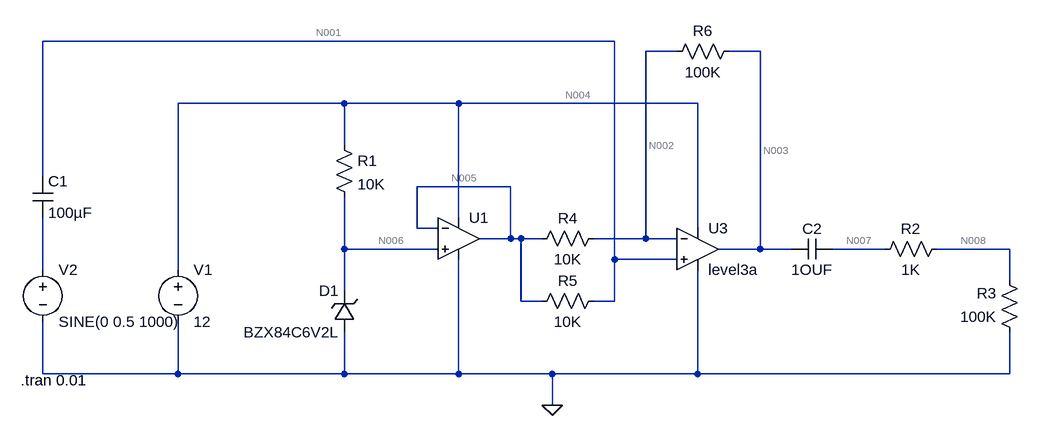
[diagram p0: schematic OUT_AMP_01.asc]
OUT_AMP_01.asc, the LTspice schematic file:
Version 4
SHEET 1 996 680
WIRE 368 -112 -512 -112
WIRE 464 -96 416 -96
WIRE 592 -96 544 -96
WIRE -48 -16 -304 -16
WIRE 128 -16 -48 -16
WIRE 496 -16 128 -16
WIRE -48 48 -48 -16
WIRE -512 96 -512 -112
WIRE 208 112 64 112
WIRE 128 160 128 -16
WIRE 64 176 64 112
WIRE 96 176 64 176
WIRE 496 176 496 -16
WIRE 208 192 208 112
WIRE 208 192 160 192
WIRE 224 192 208 192
WIRE 256 192 224 192
WIRE 416 192 416 -96
WIRE 416 192 336 192
WIRE 464 192 416 192
WIRE -48 208 -48 128
WIRE 96 208 -48 208
WIRE 592 208 592 -96
WIRE 592 208 528 208
WIRE 640 208 592 208
WIRE 784 208 704 208
WIRE 976 208 864 208
WIRE 368 224 368 -112
WIRE 464 224 368 224
WIRE -512 240 -512 160
WIRE -304 240 -304 -16
WIRE 976 256 976 208
WIRE -48 272 -48 208
WIRE 224 288 224 192
WIRE 256 288 224 288
WIRE 368 288 368 224
WIRE 368 288 336 288
WIRE -512 400 -512 320
WIRE -304 400 -304 320
WIRE -304 400 -512 400
WIRE -48 400 -48 336
WIRE -48 400 -304 400
WIRE 128 400 128 224
WIRE 128 400 -48 400
WIRE 272 400 128 400
WIRE 496 400 496 240
WIRE 496 400 272 400
WIRE 976 400 976 336
WIRE 976 400 496 400
WIRE 272 448 272 400
FLAG 272 448 0
DATAFLAG 32 208 ""
SYMBOL Opamps\\UniversalOpamp 128 192 R0
SYMATTR InstName U1
SYMBOL res -64 32 R0
SYMATTR InstName R1
SYMATTR Value 10K
SYMBOL voltage -304 224 R0
SYMATTR InstName V1
SYMATTR Value 12
SYMBOL voltage -512 224 R0
WINDOW 123 0 0 Left 0
WINDOW 39 0 0 Left 0
SYMATTR InstName V2
SYMATTR Value SINE(0 0.5 1000)
SYMBOL zener -32 336 R180
WINDOW 0 24 64 Left 2
WINDOW 3 24 0 Left 2
SYMATTR InstName D1
SYMATTR Value BZX84C6V2L
SYMBOL cap -528 96 R0
SYMATTR InstName C1
SYMATTR Value 100µF
SYMBOL cap 704 192 R90
WINDOW 0 0 32 VBottom 2
WINDOW 3 32 32 VTop 2
SYMATTR InstName C2
SYMATTR Value 1OUF
SYMBOL res 880 192 R90
WINDOW 0 0 56 VBottom 2
WINDOW 3 32 56 VTop 2
SYMATTR InstName R2
SYMATTR Value 1K
SYMBOL res 992 352 R180
WINDOW 0 36 76 Left 2
WINDOW 3 36 40 Left 2
SYMATTR InstName R3
SYMATTR Value 100K
SYMBOL res 352 176 R90
WINDOW 0 0 56 VBottom 2
WINDOW 3 32 56 VTop 2
SYMATTR InstName R4
SYMATTR Value 10K
SYMBOL res 352 272 R90
WINDOW 0 0 56 VBottom 2
WINDOW 3 32 56 VTop 2
SYMATTR InstName R5
SYMATTR Value 10K
SYMBOL res 560 -112 R90
WINDOW 0 0 56 VBottom 2
WINDOW 3 32 56 VTop 2
SYMATTR InstName R6
SYMATTR Value 100K
SYMBOL Opamps\\UniversalOpamp3 496 208 R0
SYMATTR InstName U3
TEXT -546 410 Left 2 !.tran 0.01

The netlist it stands for:
* OUT_AMP_01.asc
XU1 N006 N005 N004 0 N005 level1 Avol=1Meg GBW=10Meg Vos=0 En=0 Enk=0 In=0 Ink=0 Rin=500Meg  ; pins In+ In- V+ V- OUT
R1 N004 N006 10K
V1 N004 0 12
V2 N009 0 SINE(0 0.5 1000)
D1 0 N006 BZX84C6V2L
C1 N001 N009 100µF
C2 N007 N003 1OUF
R2 N008 N007 1K
R3 0 N008 100K
R4 N002 N005 10K
R5 N001 N005 10K
R6 N003 N002 100K
XU3 N001 N002 N004 0 N003 level3a  ; pins In+ In- V+ V- OUT
.model D D
.lib standard.dio
.tran 0.01
.lib UniversalOpAmp1.lib
.backanno
.end

* Results of the author's LTspice run, read from the files saved beside the schematic
* Operating Point, zero values left out:
*   V(n005) = 6.159 V
*   V(n006) = 6.159 V
*   V(n004) = 12 V
*   V(n001) = 6.159 V
*   V(n007) = 622 nV
*   V(n003) = 6.159 V
*   V(n008) = 615.9 nV
*   V(n002) = 6.159 V
*   I(C2) = -6.159 pA
*   I(D1) = -584.1 µA
*   I(R6) = -15.94 pA
*   I(R5) = -317.1 pA
*   I(R4) = -333.1 pA
*   I(R3) = -6.159 pA
*   I(R2) = -6.159 pA
*   I(R1) = 584.1 µA
*   I(V1) = -1.184 mA
*   Ix(u1:1) = 317.2 pA
*   Ix(u1:2) = 317.1 pA
*   Ix(u1:3) = 11.68 nA
*   Ix(u1:4) = -12.32 nA
*   Ix(u1:5) = -3.035 nA
*   Ix(u3:1) = 317.1 pA
*   Ix(u3:2) = 317.1 pA
*   Ix(u3:3) = 599.8 µA
*   Ix(u3:4) = -599.8 µA
*   Ix(u3:5) = 9.785 pA
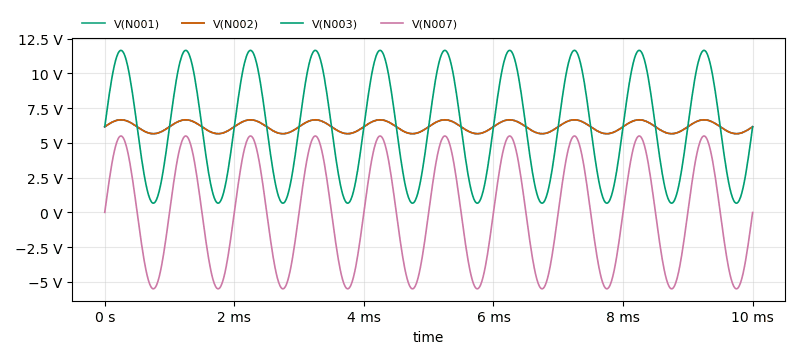
[diagram p1: Transient Analysis of OUT_AMP_01.asc, plotted from the saved traces]
* Transient Analysis, 1 run:
*   V(N001): min 5.659 V, max 6.658 V, average 6.158 V, rms 6.169 V, last 6.159 V
*   V(N002): min 5.659 V, max 6.658 V, average 6.158 V, rms 6.169 V, last 6.158 V
*   V(N003): min 662.8 mV, max 11.65 V, average 6.157 V, rms 7.282 V, last 6.153 V
*   V(N007): min -5.496 V, max 5.494 V, average -1.501 mV, rms 3.887 V, last -6.055 mV